# Altium schematic sheet Resistor.SchDoc
size A
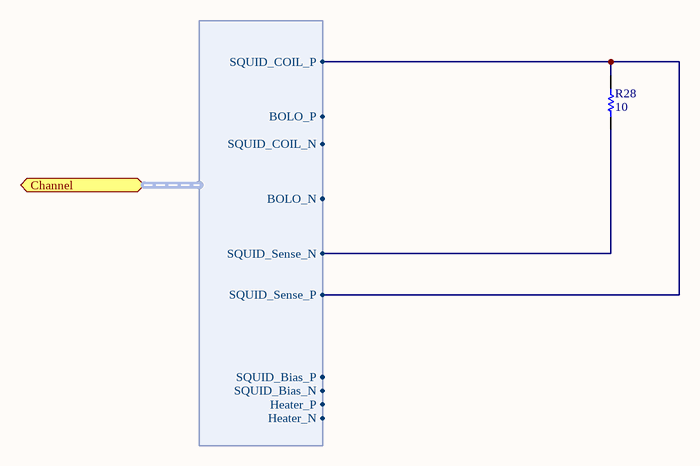
[diagram p0: Resistor.SchDoc]

## Parts
R28  10  [0603]

## Ports
Channel (harness SQUID_CH_IN)

## Harnesses
SQUID_CH_IN: SQUID_COIL_P, SQUID_COIL_N, BOLO_P, BOLO_N, SQUID_Sense_P, SQUID_Bias_P, SQUID_Bias_N, Heater_P, SQUID_Sense_N, Heater_N

## Nets
NetR28_1: R28.1 ; port Channel.SQUID_Sense_N
NetR28_2: R28.2 ; port Channel.SQUID_COIL_P, port Channel.SQUID_Sense_P

## Library data of the parts
R28 = RES 0603: 10 Ohm RES 0603; Manufacturer: Vishay Dale; Part Constraints: RES 10 OHM 1/10W 1% 0603 SMD; Manufacturer Part Number: CRCW060310R0FKEA; Assembly Comments: none; Value: 10; Cost: $0.124; Supplier: Digikey; Supplier Part Number: 541-10.0HCT-ND; Type: SMD